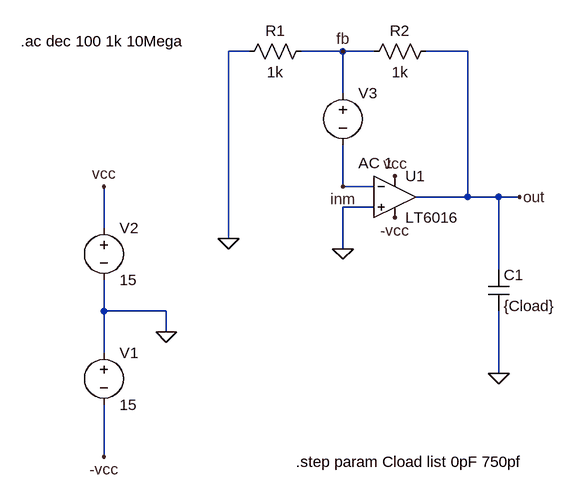
[diagram p0: schematic stability.asc]
stability.asc, the LTspice schematic file:
Version 4
SHEET 1 880 680
WIRE -16 -64 -48 -64
WIRE 128 -64 64 -64
WIRE 176 -64 128 -64
WIRE 320 -64 256 -64
WIRE 128 0 128 -64
WIRE 128 144 128 80
WIRE 176 144 128 144
WIRE 320 160 320 -64
WIRE 320 160 240 160
WIRE 368 160 320 160
WIRE 400 160 368 160
WIRE 176 176 128 176
WIRE -240 208 -240 144
WIRE -48 224 -48 -64
WIRE 128 240 128 176
WIRE 368 272 368 160
WIRE -240 336 -240 288
WIRE -144 336 -240 336
WIRE -144 368 -144 336
WIRE -240 400 -240 336
WIRE 368 432 368 336
WIRE -240 560 -240 480
FLAG 128 240 0
FLAG -48 224 0
FLAG -144 368 0
FLAG -240 144 vcc
FLAG -240 560 -vcc
FLAG 208 128 vcc
FLAG 208 192 -vcc
FLAG 128 -64 fb
FLAG 128 144 inm
FLAG 400 160 out
FLAG 368 432 0
SYMBOL OpAmps\\LT6016 208 160 R0
SYMATTR InstName U1
SYMBOL res 80 -80 R90
WINDOW 0 0 56 VBottom 2
WINDOW 3 32 56 VTop 2
SYMATTR InstName R1
SYMATTR Value 1k
SYMBOL res 272 -80 R90
WINDOW 0 0 56 VBottom 2
WINDOW 3 32 56 VTop 2
SYMATTR InstName R2
SYMATTR Value 1k
SYMBOL voltage -240 384 R0
WINDOW 123 0 0 Left 0
WINDOW 39 0 0 Left 0
SYMATTR InstName V1
SYMATTR Value 15
SYMBOL voltage -240 192 R0
WINDOW 123 0 0 Left 0
WINDOW 39 0 0 Left 0
SYMATTR InstName V2
SYMATTR Value 15
SYMBOL voltage 128 -16 R0
WINDOW 123 24 124 Left 2
WINDOW 39 0 0 Left 0
SYMATTR InstName V3
SYMATTR Value ""
SYMATTR Value2 AC 1
SYMBOL cap 352 272 R0
SYMATTR InstName C1
SYMATTR Value {Cload}
TEXT -368 -80 Left 2 !.ac dec 100 1k 10Mega
TEXT 56 568 Left 2 !.step param Cload list 0pF 750pf

The netlist it stands for:
* stability.asc
* U1: LT6016 (symbol OpAmps\LT6016 not available, pins judged from their places): In+=0 In-=inm V+=vcc V-=-vcc OUT=out
R1 fb 0 1k
R2 out fb 1k
V1 0 -vcc 15
V2 vcc 0 15
V3 fb inm AC 1
C1 out 0 {Cload}
.ac dec 100 1k 10Mega
.step param Cload list 0pF 750pf
.backanno
.end